# Altium schematic sheet acronyms.SchDoc
size 420 x 297 mm
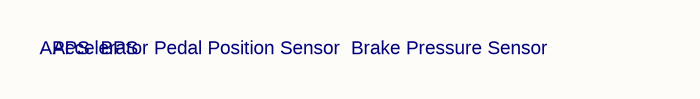
[diagram p0: acronyms.SchDoc]

## Notes on the sheet
- APPS
  BPS
- Accelerator Pedal Position Sensor
  Brake Pressure Sensor
- 1
- 2
- 3
- 4
- 5
- 6
- 7
- 8
- A
- B
- C
- D
- E
- Title: MISC - ACRONYMS
- File: acronyms.kicad_sch
- Sheet: /
- F
- KiCad E.D.A.  kicad (5.1.4)-1
- Size: A3
- Date:
- Rev:
- Id: 1/1